# Altium schematic sheet SUPLY.SchDoc
size A4
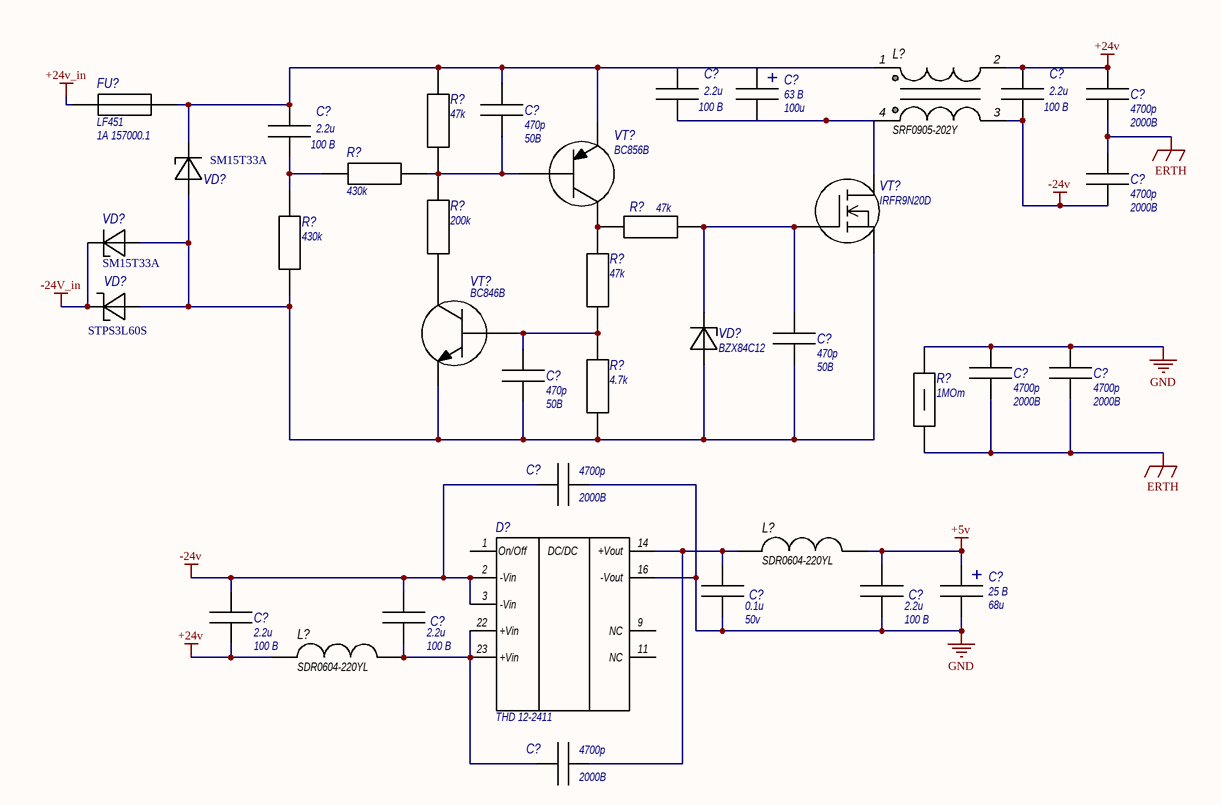
[diagram p0: SUPLY.SchDoc]

## Parts
(Parts that share a designator on the sheet are numbered #1, #2 ... from top to bottom, then left to right.)
C?#1  value 2.2u  Voltage: 100 В  [C1210_]  (hidden comment: Capacitor ceramic)
C?#2  value 100u  Voltage: 63 В  [rad_cap_10х12]  (hidden comment: Capacitor electrolytic)
C?#3  value 2.2u  Voltage: 100 В  [C1210_]  (hidden comment: Capacitor ceramic)
C?#4  value 4700p  Voltage: 2000В  [C1812_]  (hidden comment: Capacitor ceramic)
C?#5  Voltage: 50В  [C0603]  (hidden comment: 470p)
C?#6  value 2.2u  Voltage: 100 В  [C1210_]  (hidden comment: Capacitor ceramic)
C?#7  value 4700p  Voltage: 2000В  [C1812_]  (hidden comment: Capacitor ceramic)
C?#8  Voltage: 50В  [C0603]  (hidden comment: 470p)
C?#9  value 4700p  Voltage: 2000В  [C1812_]  (hidden comment: Capacitor ceramic)
C?#10  value 4700p  Voltage: 2000В  [C1812_]  (hidden comment: Capacitor ceramic)
C?#11  Voltage: 50В  [C0603]  (hidden comment: 470p)
C?#12  value 4700p  Voltage: 2000В  [C1812_]  (hidden comment: Capacitor ceramic)
C?#13  value 0.1u  Voltage: 50v  [C0603]  (hidden comment: Capacitor ceramic)
C?#14  value 2.2u  Voltage: 100 В  [C1210_]  (hidden comment: Capacitor ceramic)
C?#15  value 68u  Voltage: 25 В  [D_]  (hidden comment: T491)
C?#16  value 2.2u  Voltage: 100 В  [C1210_]  (hidden comment: Capacitor ceramic)
C?#17  value 2.2u  Voltage: 100 В  [C1210_]  (hidden comment: Capacitor ceramic)
C?#18  value 4700p  Voltage: 2000В  [C1812_]  (hidden comment: Capacitor ceramic)
D?  Type: THD 12-2411  [THD_12-2411]  (hidden comment: TMR 3-2422)
FU?  value 1A 157000.1  [LF451-1]  (hidden comment: LF451)
L?#1  value SRF0905-202Y  [SRF0905]  (hidden comment: SRF0905)
L?#2  value SDR0604-220YL  [SDR0604_]  (hidden comment: SDR0604_1)
L?#3  value SDR0604-220YL  [SDR0604_]  (hidden comment: SDR0604_1)
R?#1  value 47k  [R0603]  (hidden comment: 47k ±5%)
R?#2  value 430k  [R0603]  (hidden comment: 430k ±5%)
R?#3  value 200k  [R0603]  (hidden comment: 200k ±5%)
R?#4  value 47k  [R0603]  (hidden comment: 47k ±5%)
R?#5  value 430k  [R0603]  (hidden comment: 430k ±5%)
R?#6  value 47k  [R0603]  (hidden comment: 47k ±5%)
R?#7  value 4.7k  [R0603]  (hidden comment: 4.7k ±5%)
R?#8  value 1MOm  [R1210]  (hidden comment: 1MOm ±5%)
VD?#1  SM15T33A  [SMC]
VD?#2  SM15T33A  [SMC]
VD?#3  STPS3L60S  [SMC]
VD?#4  Type: BZX84C12  [SOT-23]  (hidden comment: BZX84)
VT?#1  Type: BC856B  [SOT-23]  (hidden comment: BC807)
VT?#2  Type: IRFR9N20D  [D-PAK]  (hidden comment: IRFR4620)
VT?#3  Type: BC846B  [SOT-23]  (hidden comment: BC817)

## Nets
+5v: C?#14.2 C?#15.1 L?#2.2
+24v: C?#3.2 C?#4.2 C?#16.1 L?#1.2 L?#3.1
+24v_in: FU?.1
-24v: C?#3.1 C?#7.1 C?#12.1 C?#16.2 C?#17.2 D?.2(-Vin) D?.3(-Vin) L?#1.3
-24V_in: VD?#2.3(K) VD?#3.3(K)
ERTH: C?#4.1 C?#7.2 C?#9.1 C?#10.1 R?#8.1
GND: C?#9.2 C?#10.2 C?#12.2 C?#13.1 C?#14.1 C?#15.2 D?.16(-Vout) R?#8.2
NetC?#1_1: C?#1.1 C?#2.2(K) L?#1.4 VT?#2.3
NetC?#1_2: C?#1.2 C?#2.1(A) C?#5.2 C?#6.2 FU?.2 L?#1.1 R?#1.1 VD?#1.3(K) VT?#1.2
NetC?#5_1: C?#5.1 R?#1.2 R?#2.1 R?#3.1 VT?#1.1
NetC?#6_1: C?#6.1 R?#2.2 R?#5.2
NetC?#8_1: C?#8.1 C?#11.1 R?#5.1 R?#7.1 VD?#1.VD(A) VD?#2.VD(A) VD?#3.1(A) VD?#4.1(A) VT?#2.2 VT?#3.2
NetC?#8_2: C?#8.2 R?#4.2 VD?#4.3(K) VT?#2.1
NetC?#11_2: C?#11.2 R?#6.1 R?#7.2 VT?#3.1
NetC?#13_2: C?#13.2 C?#18.2 D?.14(+Vout) L?#2.1
NetC?#17_1: C?#17.1 C?#18.1 D?.22(+Vin) D?.23(+Vin) L?#3.2
NetR?#3_2: R?#3.2 VT?#3.3
NetR?#4_1: R?#4.1 R?#6.2 VT?#1.3

Not connected (* = marked no-connect by the designer): D? 1(On/Off) 9(NC) 11(NC)

## Notes on the sheet
- (in symbol Capacitor electrolytic) +
- (in symbol Capacitor tantal) +
- (in symbol TMR 3-2422) DC/DC

## Library data of the parts
C?#1 C?#3 C?#6 C?#14 C?#16 C?#17 = Capacitor ceramic: Capacitance: 2.2u x 100 В; Dielectric: *; Tolerance: *
C?#2 = Capacitor electrolytic: radial 10x12; Tolerance: ±20%; Polarization: Polar; Capacitance: 100u x 63 В; Famile: Capacitor; Category: Capacitors; Operating Temperature: -40°C ~ 105°C; Package / Case: Radial, Can - SMD; ComponentLink1Description: Параметры; ComponentLink1URL: 5\res\Справочники\Конденсаторы\KEM_A4003_EXV.pdf; Dielectric: *
C?#4 C?#7 C?#9 C?#10 C?#12 C?#18 = Capacitor ceramic: Capacitance: 4700p x 2000В; Dielectric: *; Tolerance: *
C?#5 C?#8 C?#11 = Capacitor ceramic: Capacitance: 470p x 50В; Dielectric: *; Tolerance: *; Value: 470p
C?#13 = Capacitor ceramic: Capacitance: 0.1u x 50v; Dielectric: *; Tolerance: *
C?#15 = Capacitor tantal: Solid Tantalum Chip Capacitor, Standard T491 Series - Industrial Grade; Capacitance: 68u x 25 В; ComponentLink1Description: Manufacturer Link; ComponentLink2Description: Datasheet; ComponentLink1URL: http://www.kemet.com/; ComponentLink2URL: http://www.kemet.com/kemet/web/homepage/kechome.nsf/vapubfilesname/F3102TA.pdf/$file/F3102TA.pdf; Dielectric: *; Tolerance: *
L?#2 L?#3 = SDR0604_1: SDR0604
R?#1-R?#7 = R0603: Precision: ±5%
R?#8 = R1210: Precision: ±5%
VD?#1 VD?#2 = Stab: stab 33V
VD?#3 = Shotky: shotky 60v 3A
FU? = LF451: Type: LF451